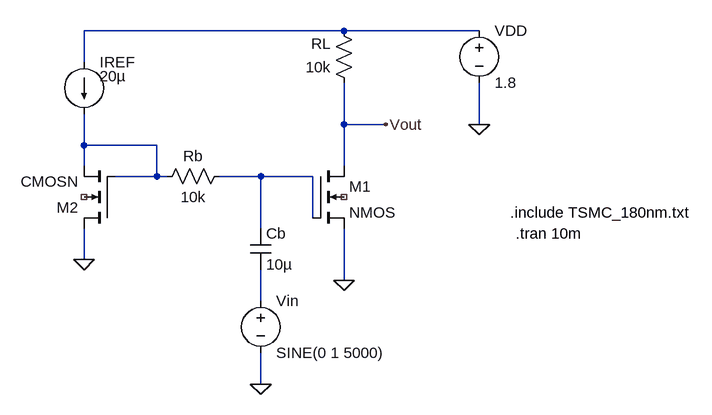
[diagram p0: schematic 6l.asc]
6l.asc, the LTspice schematic file:
Version 4
SHEET 1 1096 680
WIRE 560 80 160 80
WIRE 768 80 560 80
WIRE 160 128 160 80
WIRE 560 224 560 160
WIRE 624 224 560 224
WIRE 768 224 768 160
WIRE 160 256 160 208
WIRE 272 256 160 256
WIRE 160 288 160 256
WIRE 560 288 560 224
WIRE 272 304 272 256
WIRE 272 304 208 304
WIRE 288 304 272 304
WIRE 432 304 368 304
WIRE 512 304 432 304
WIRE 512 368 512 304
WIRE 432 384 432 304
WIRE 160 432 160 384
WIRE 560 464 560 384
WIRE 432 496 432 448
WIRE 432 624 432 576
FLAG 160 432 0
FLAG 432 624 0
FLAG 560 464 0
FLAG 768 224 0
FLAG 624 224 Vout
SYMBOL nmos4 512 288 R0
SYMATTR InstName M1
SYMATTR Value2 l=0.18u w=1.8u ad=1.8p as=1.8p pd=4.5u ps=4.5u
SYMBOL nmos4 208 384 R180
SYMATTR InstName M2
SYMATTR Value CMOSN
SYMATTR Value2 l=1.8u w=0.18u ad=1.8p as=1.8p pd=4.5u ps=4.5u
SYMBOL res 384 288 R90
WINDOW 0 0 56 VBottom 2
WINDOW 3 32 56 VTop 2
SYMATTR InstName Rb
SYMATTR Value 10k
SYMBOL res 576 176 R180
WINDOW 0 36 76 Left 2
WINDOW 3 36 40 Left 2
SYMATTR InstName RL
SYMATTR Value 10k
SYMBOL cap 416 384 R0
SYMATTR InstName Cb
SYMATTR Value 10µ
SYMBOL voltage 768 64 R0
SYMATTR InstName VDD
SYMATTR Value 1.8
SYMBOL voltage 432 480 R0
SYMATTR InstName Vin
SYMATTR Value SINE(0 1 5000)
SYMBOL current 160 128 R0
WINDOW 3 24 22 Left 2
SYMATTR Value 20µ
SYMATTR InstName IREF
TEXT 816 360 Left 2 !.include TSMC_180nm.txt
TEXT 824 392 Left 2 !.tran 10m

The netlist it stands for:
* 6l.asc
M1 Vout N003 0 NC_01 NMOS l=0.18u w=1.8u ad=1.8p as=1.8p pd=4.5u ps=4.5u
M2 0 N002 N002 NC_02 CMOSN l=1.8u w=0.18u ad=1.8p as=1.8p pd=4.5u ps=4.5u
Rb N003 N002 10k
RL Vout N001 10k
Cb N003 N004 10µ
VDD N001 0 1.8
Vin N004 0 SINE(0 1 5000)
IREF N001 N002 20µ
.model NMOS NMOS
.model PMOS PMOS
.lib standard.mos
.include TSMC_180nm.txt
.tran 10m
.backanno
.end